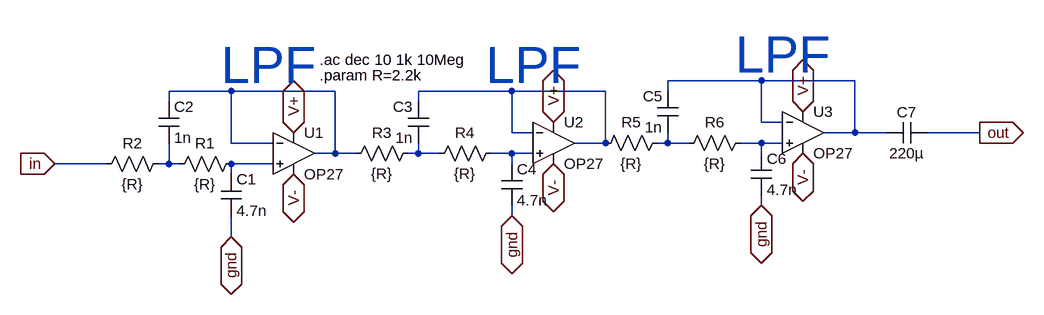
[diagram p0: schematic bandpass2.asc]
bandpass2.asc, the LTspice schematic file:
Version 4.1
SHEET 1 1460 680
WIRE 880 48 736 48
WIRE 1024 48 880 48
WIRE 64 64 -32 64
WIRE 224 64 64 64
WIRE 496 64 352 64
WIRE 640 64 496 64
WIRE 736 64 736 48
WIRE -32 80 -32 64
WIRE 352 80 352 64
WIRE 880 112 880 48
WIRE 912 112 880 112
WIRE 496 128 496 64
WIRE 528 128 496 128
WIRE 1024 128 1024 48
WIRE 1024 128 976 128
WIRE 1072 128 1024 128
WIRE 1216 128 1136 128
WIRE 64 144 64 64
WIRE 128 144 64 144
WIRE 640 144 640 64
WIRE 640 144 592 144
WIRE 736 144 736 128
WIRE 736 144 720 144
WIRE 768 144 736 144
WIRE 880 144 848 144
WIRE 912 144 880 144
WIRE 224 160 224 64
WIRE 224 160 192 160
WIRE 256 160 224 160
WIRE 352 160 352 144
WIRE 352 160 336 160
WIRE 384 160 352 160
WIRE 496 160 464 160
WIRE 528 160 496 160
WIRE 880 160 880 144
WIRE -128 176 -208 176
WIRE -32 176 -32 144
WIRE -32 176 -48 176
WIRE -16 176 -32 176
WIRE 128 176 64 176
WIRE 496 176 496 160
WIRE 64 192 64 176
WIRE 880 240 880 224
WIRE 496 256 496 240
WIRE 64 288 64 256
FLAG 64 288 gnd
IOPIN 64 288 BiDir
FLAG 496 256 gnd
IOPIN 496 256 BiDir
FLAG 160 128 V+
IOPIN 160 128 BiDir
FLAG 560 112 V+
IOPIN 560 112 BiDir
FLAG 160 192 V-
IOPIN 160 192 BiDir
FLAG 560 176 V-
IOPIN 560 176 BiDir
FLAG -208 176 in
IOPIN -208 176 In
FLAG 1216 128 out
IOPIN 1216 128 Out
FLAG 880 240 gnd
IOPIN 880 240 BiDir
FLAG 944 96 V+
IOPIN 944 96 BiDir
FLAG 944 160 V-
IOPIN 944 160 BiDir
SYMBOL OpAmps\\OP27 160 96 R0
SYMATTR InstName U1
SYMBOL res 240 176 R270
WINDOW 0 32 56 VTop 2
WINDOW 3 0 56 VBottom 2
SYMATTR InstName R3
SYMATTR Value {R}
SYMBOL cap 368 144 R180
WINDOW 0 24 56 Left 2
WINDOW 3 24 8 Left 2
SYMATTR InstName C3
SYMATTR Value 1n
SYMBOL res 368 176 R270
WINDOW 0 32 56 VTop 2
WINDOW 3 0 56 VBottom 2
SYMATTR InstName R4
SYMATTR Value {R}
SYMBOL cap 480 176 R0
SYMATTR InstName C4
SYMATTR Value 4.7n
SYMBOL OpAmps\\OP27 560 80 R0
SYMATTR InstName U2
SYMBOL cap 48 192 R0
SYMATTR InstName C1
SYMATTR Value 4.7n
SYMBOL cap -48 80 R0
SYMATTR InstName C2
SYMATTR Value 1n
SYMBOL res -32 192 R270
WINDOW 0 32 56 VTop 2
WINDOW 3 0 56 VBottom 2
SYMATTR InstName R1
SYMATTR Value {R}
SYMBOL res -144 192 R270
WINDOW 0 32 56 VTop 2
WINDOW 3 0 56 VBottom 2
SYMATTR InstName R2
SYMATTR Value {R}
SYMBOL res 624 160 R270
WINDOW 0 32 56 VTop 2
WINDOW 3 0 56 VBottom 2
SYMATTR InstName R5
SYMATTR Value {R}
SYMBOL cap 752 128 R180
WINDOW 0 24 56 Left 2
WINDOW 3 24 8 Left 2
SYMATTR InstName C5
SYMATTR Value 1n
SYMBOL res 752 160 R270
WINDOW 0 32 56 VTop 2
WINDOW 3 0 56 VBottom 2
SYMATTR InstName R6
SYMATTR Value {R}
SYMBOL cap 864 160 R0
SYMATTR InstName C6
SYMATTR Value 4.7n
SYMBOL OpAmps\\OP27 944 64 R0
SYMATTR InstName U3
SYMBOL cap 1072 144 R270
WINDOW 0 32 32 VTop 2
WINDOW 3 0 32 VBottom 2
SYMATTR InstName C7
SYMATTR Value 220µ
TEXT 456 24 Left 6 ;LPF
TEXT 48 24 Left 6 ;LPF
TEXT 200 16 Left 2 !.ac dec 10 1k 10Meg
TEXT 840 8 Left 6 ;LPF
TEXT 200 40 Left 2 !.param R=2.2k

The netlist it stands for:
* bandpass2.asc
X§U1 N009 N002 V+ V- N002 OP27  ; pins In+ In- V+ V- OUT
R3 N002 N006 {R}
C3 N006 N003 1n
R4 N006 N007 {R}
C4 N007 gnd 4.7n
X§U2 N007 N003 V+ V- N003 OP27  ; pins In+ In- V+ V- OUT
C1 N009 gnd 4.7n
C2 N002 N008 1n
R1 N008 N009 {R}
R2 in N008 {R}
R5 N003 N004 {R}
C5 N004 N001 1n
R6 N004 N005 {R}
C6 N005 gnd 4.7n
X§U3 N005 N001 V+ V- N001 OP27  ; pins In+ In- V+ V- OUT
C7 N001 out 220µ
* LPF
* LPF
.ac dec 10 1k 10Meg
* LPF
.param R=2.2k
.lib ADI.lib
.backanno
.end